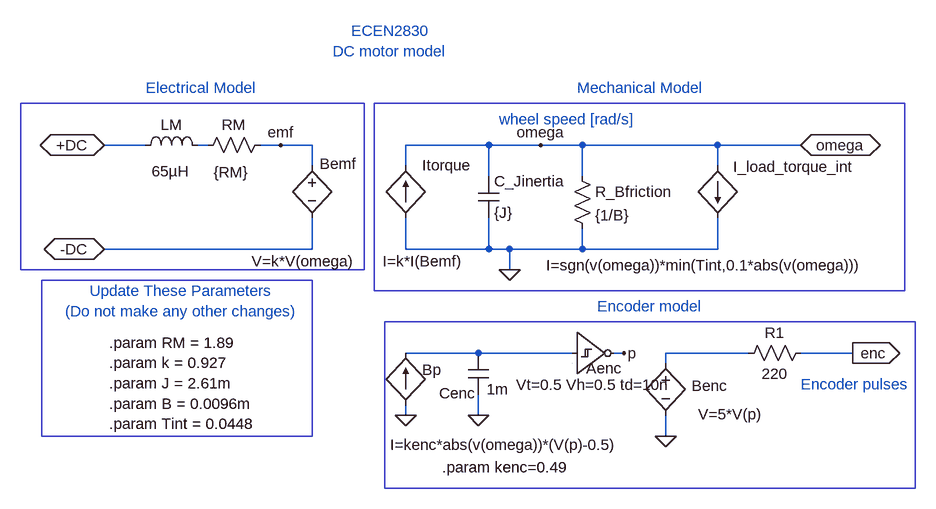
[diagram p0: schematic DC_motor_model.asc]
DC_motor_model.asc, the LTspice schematic file:
Version 4
SHEET 1 880 680
WIRE -528 -176 -592 -176
WIRE -432 -176 -448 -176
WIRE -320 -176 -352 -176
WIRE -272 -176 -320 -176
WIRE 0 -176 -128 -176
WIRE 80 -176 0 -176
WIRE 144 -176 80 -176
WIRE 352 -176 144 -176
WIRE 480 -176 352 -176
WIRE -272 -144 -272 -176
WIRE -128 -144 -128 -176
WIRE 352 -144 352 -176
WIRE 0 -128 0 -176
WIRE 144 -128 144 -176
WIRE -272 -16 -272 -64
WIRE -272 -16 -592 -16
WIRE -128 -16 -128 -64
WIRE 0 -16 0 -64
WIRE 0 -16 -128 -16
WIRE 32 -16 0 -16
WIRE 144 -16 144 -48
WIRE 144 -16 32 -16
WIRE 352 -16 352 -64
WIRE 352 -16 144 -16
WIRE 32 16 32 -16
WIRE -16 144 -128 144
WIRE 128 144 -16 144
WIRE 208 144 192 144
WIRE 400 144 272 144
WIRE 560 144 480 144
WIRE 272 160 272 144
WIRE -128 240 -128 224
WIRE -16 240 -16 208
WIRE 272 272 272 240
FLAG 560 144 enc
IOPIN 560 144 Out
FLAG -128 240 0
FLAG -16 240 0
FLAG 80 -176 omega
FLAG -320 -176 emf
FLAG 208 144 p
FLAG 272 272 0
FLAG -592 -176 +DC
IOPIN -592 -176 BiDir
FLAG -592 -16 -DC
IOPIN -592 -16 BiDir
FLAG 480 -176 omega
IOPIN 480 -176 BiDir
FLAG 32 16 0
SYMBOL Digital\\schmtinv 128 80 R0
WINDOW 3 -86 113 Left 2
WINDOW 0 22 87 Left 2
SYMATTR Value Vt=0.5 Vh=0.5 td=10n
SYMATTR InstName Aenc
SYMBOL bi -128 224 R180
WINDOW 0 -55 54 Left 2
WINDOW 3 -329 -61 Left 2
SYMATTR InstName Bp
SYMATTR Value I=kenc*abs(v(omega))*(V(p)-0.5)
SYMBOL cap -32 144 R0
WINDOW 0 -44 62 Left 2
WINDOW 3 29 56 Left 2
SYMATTR InstName Cenc
SYMATTR Value 1m
SYMBOL ind -544 -160 R270
WINDOW 0 32 56 VTop 2
WINDOW 3 -9 54 VBottom 2
SYMATTR InstName LM
SYMATTR Value 65µH
SYMBOL res -448 -160 R270
WINDOW 0 32 56 VTop 2
WINDOW 3 -10 52 VBottom 2
SYMATTR InstName RM
SYMATTR Value {RM}
SYMBOL bv -272 -160 R0
WINDOW 0 12 13 Left 2
WINDOW 3 -93 163 Left 2
SYMATTR InstName Bemf
SYMATTR Value V=k*V(omega)
SYMBOL bi -128 -64 R180
WINDOW 0 -101 81 Left 2
WINDOW 3 -86 -67 Left 2
SYMATTR InstName Itorque
SYMATTR Value I=k*I(Bemf)
SYMBOL cap -16 -128 R0
SYMATTR InstName C_Jinertia
SYMATTR Value {J}
SYMBOL res 128 -144 R0
SYMATTR InstName R_Bfriction
SYMATTR Value {1/B}
SYMBOL bv 272 144 R0
WINDOW 0 40 50 Left 2
WINDOW 3 50 94 Left 2
SYMATTR InstName Benc
SYMATTR Value V=5*V(p)
SYMBOL bi 352 -144 R0
WINDOW 3 -264 153 Left 2
WINDOW 0 24 1 Left 2
SYMATTR Value I=sgn(v(omega))*min(Tint,0.1*abs(v(omega)))
SYMATTR InstName I_load_torque_int
SYMBOL res 496 128 R90
WINDOW 0 0 56 VBottom 2
WINDOW 3 32 56 VTop 2
SYMATTR InstName R1
SYMATTR Value 220
TEXT -72 320 Left 2 !.param kenc=0.49
TEXT -152 -336 Center 2 ;ECEN2830\nDC motor model
TEXT 16 -216 Left 2 ;wheel speed [rad/s]
TEXT 480 192 Left 2 ;Encoder pulses
TEXT 248 72 Center 2 ;Encoder model
TEXT -584 128 Left 2 !.param RM = 1.89\n.param k = 0.927\n.param J = 2.61m\n.param B = 0.0096m\n.param Tint = 0.0448
TEXT -472 64 Center 2 ;Update These Parameters\n(Do not make any other changes)
TEXT -528 -264 Left 2 ;Electrical Model
TEXT 136 -264 Left 2 ;Mechanical Model
RECTANGLE Normal -272 272 -688 32
RECTANGLE Normal -192 16 -720 -240
RECTANGLE Normal 640 48 -176 -240
RECTANGLE Normal 656 352 -160 96

The netlist it stands for:
* DC_motor_model.asc
Aenc N002 0 0 0 0 p 0 0 SCHMITT Vt=0.5 Vh=0.5 td=10n
Bp 0 N002 I=kenc*abs(v(omega))*(V(p)-0.5)
Cenc N002 0 1m
LM +DC N001 65µH
RM N001 emf {RM}
Bemf emf -DC V=k*V(omega)
B§Itorque 0 omega I=k*I(Bemf)
C_Jinertia omega 0 {J}
R_Bfriction omega 0 {1/B}
Benc N003 0 V=5*V(p)
B§I_load_torque_int omega 0 I=sgn(v(omega))*min(Tint,0.1*abs(v(omega)))
R1 enc N003 220
.param kenc=0.49
* ECEN2830
* DC motor model
* wheel speed [rad/s]
* Encoder pulses
* Encoder model
.param RM = 1.89
.param k = 0.927
.param J = 2.61m
.param B = 0.0096m
.param Tint = 0.0448
* Update These Parameters
* (Do not make any other changes)
* Electrical Model
* Mechanical Model
.backanno
.end